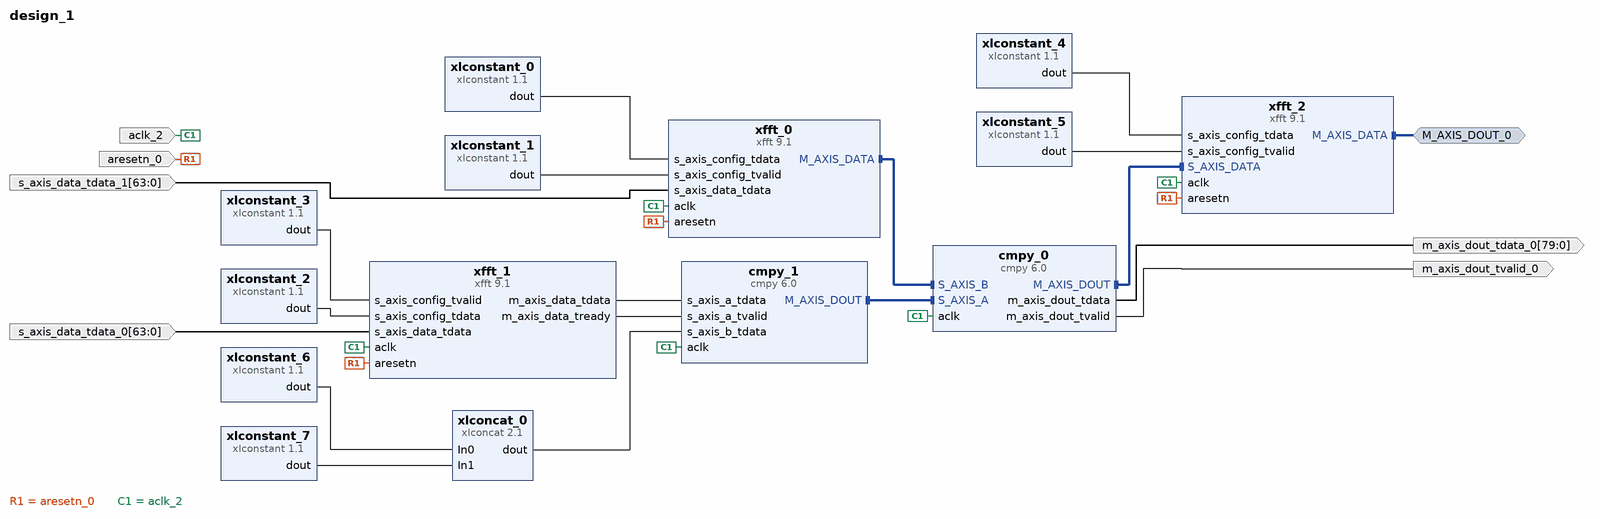
[diagram p0: block diagram of the top level]
# Vivado block design design_1, xczu28dr-ffvg1517-2-e, Vivado 2020.2
create_bd_design design_1

create_bd_intf_port -mode Master -vlnv xilinx.com:interface:axis_rtl:1.0 M_AXIS_DOUT_0
create_bd_port -dir I -type clk aclk_2
create_bd_port -dir I -type rst aresetn_0
create_bd_port -dir O -from 79 -to 0 m_axis_dout_tdata_0
create_bd_port -dir O m_axis_dout_tvalid_0
create_bd_port -dir I -from 63 -to 0 s_axis_data_tdata_0
create_bd_port -dir I -from 63 -to 0 s_axis_data_tdata_1

create_bd_cell -type ip -vlnv xilinx.com:ip:xfft:9.1 xfft_0
set_property -dict [list \
  CONFIG.aresetn true \
  CONFIG.channels 1 \
  CONFIG.data_format fixed_point \
  CONFIG.implementation_options automatically_select \
  CONFIG.number_of_stages_using_block_ram_for_data_and_phase_factors 3 \
  CONFIG.output_ordering natural_order \
  CONFIG.phase_factor_width 24 \
  CONFIG.target_data_throughput 50 \
  CONFIG.transform_length 1024 \
] [get_bd_cells xfft_0]
create_bd_cell -type ip -vlnv xilinx.com:ip:xlconstant:1.1 xlconstant_0
set_property -dict {CONFIG.CONST_WIDTH 64} [get_bd_cells xlconstant_0]
create_bd_cell -type ip -vlnv xilinx.com:ip:xlconstant:1.1 xlconstant_1
set_property -dict {CONFIG.CONST_WIDTH 1} [get_bd_cells xlconstant_1]
create_bd_cell -type ip -vlnv xilinx.com:ip:xlconstant:1.1 xlconstant_2
set_property -dict {CONFIG.CONST_WIDTH 64} [get_bd_cells xlconstant_2]
create_bd_cell -type ip -vlnv xilinx.com:ip:xlconstant:1.1 xlconstant_3
set_property -dict {CONFIG.CONST_WIDTH 1} [get_bd_cells xlconstant_3]
create_bd_cell -type ip -vlnv xilinx.com:ip:xfft:9.1 xfft_1
set_property -dict [list \
  CONFIG.aresetn true \
  CONFIG.channels 1 \
  CONFIG.data_format fixed_point \
  CONFIG.implementation_options automatically_select \
  CONFIG.number_of_stages_using_block_ram_for_data_and_phase_factors 0 \
  CONFIG.output_ordering natural_order \
  CONFIG.phase_factor_width 24 \
  CONFIG.target_data_throughput 50 \
  CONFIG.transform_length 32 \
] [get_bd_cells xfft_1]
create_bd_cell -type ip -vlnv xilinx.com:ip:cmpy:6.0 cmpy_0
set_property -dict {CONFIG.OutputWidth 32} [get_bd_cells cmpy_0]
create_bd_cell -type ip -vlnv xilinx.com:ip:xfft:9.1 xfft_2
set_property -dict [list \
  CONFIG.aresetn true \
  CONFIG.channels 1 \
  CONFIG.data_format fixed_point \
  CONFIG.implementation_options pipelined_streaming_io \
  CONFIG.number_of_stages_using_block_ram_for_data_and_phase_factors 0 \
  CONFIG.output_ordering natural_order \
  CONFIG.phase_factor_width 24 \
  CONFIG.target_data_throughput 50 \
  CONFIG.transform_length 32 \
] [get_bd_cells xfft_2]
create_bd_cell -type ip -vlnv xilinx.com:ip:xlconstant:1.1 xlconstant_4
set_property -dict {CONFIG.CONST_VAL 0 CONFIG.CONST_WIDTH 8} [get_bd_cells xlconstant_4]
create_bd_cell -type ip -vlnv xilinx.com:ip:xlconstant:1.1 xlconstant_5
set_property -dict {CONFIG.CONST_WIDTH 1} [get_bd_cells xlconstant_5]
create_bd_cell -type ip -vlnv xilinx.com:ip:cmpy:6.0 cmpy_1
create_bd_cell -type ip -vlnv xilinx.com:ip:xlconcat:2.1 xlconcat_0
set_property -dict {CONFIG.IN0_WIDTH 32 CONFIG.IN1_WIDTH 32 CONFIG.NUM_PORTS 2} [get_bd_cells xlconcat_0]
create_bd_cell -type ip -vlnv xilinx.com:ip:xlconstant:1.1 xlconstant_6
set_property -dict {CONFIG.CONST_WIDTH 32} [get_bd_cells xlconstant_6]
create_bd_cell -type ip -vlnv xilinx.com:ip:xlconstant:1.1 xlconstant_7
set_property -dict {CONFIG.CONST_VAL -1 CONFIG.CONST_WIDTH 32} [get_bd_cells xlconstant_7]

# ---- connections ----

connect_bd_intf_net [get_bd_intf_pins cmpy_1/M_AXIS_DOUT] [get_bd_intf_pins cmpy_0/S_AXIS_A]
connect_bd_intf_net [get_bd_intf_pins cmpy_0/S_AXIS_B] [get_bd_intf_pins xfft_0/M_AXIS_DATA]
connect_bd_intf_net [get_bd_intf_pins cmpy_0/M_AXIS_DOUT] [get_bd_intf_pins xfft_2/S_AXIS_DATA]
connect_bd_intf_net [get_bd_intf_ports M_AXIS_DOUT_0] [get_bd_intf_pins xfft_2/M_AXIS_DATA]
connect_bd_net [get_bd_pins xlconstant_0/dout] [get_bd_pins xfft_0/s_axis_config_tdata]
connect_bd_net [get_bd_pins xlconstant_1/dout] [get_bd_pins xfft_0/s_axis_config_tvalid]
connect_bd_net [get_bd_pins xlconstant_3/dout] [get_bd_pins xfft_1/s_axis_config_tvalid]
connect_bd_net -net aresetn_0_1 [get_bd_ports aresetn_0] [get_bd_pins xfft_0/aresetn] [get_bd_pins xfft_1/aresetn] [get_bd_pins xfft_2/aresetn]
connect_bd_net [get_bd_pins cmpy_0/m_axis_dout_tdata] [get_bd_ports m_axis_dout_tdata_0]
connect_bd_net [get_bd_pins cmpy_0/m_axis_dout_tvalid] [get_bd_ports m_axis_dout_tvalid_0]
connect_bd_net [get_bd_pins xlconstant_2/dout] [get_bd_pins xfft_1/s_axis_config_tdata]
connect_bd_net [get_bd_pins xlconstant_4/dout] [get_bd_pins xfft_2/s_axis_config_tdata]
connect_bd_net [get_bd_pins xlconstant_5/dout] [get_bd_pins xfft_2/s_axis_config_tvalid]
connect_bd_net -net aclk_2_1 [get_bd_ports aclk_2] \
  [get_bd_pins xfft_1/aclk] [get_bd_pins xfft_0/aclk] [get_bd_pins xfft_2/aclk] [get_bd_pins cmpy_0/aclk] \
  [get_bd_pins cmpy_1/aclk]
connect_bd_net -net s_axis_data_tdata_0_1 [get_bd_ports s_axis_data_tdata_0] [get_bd_pins xfft_1/s_axis_data_tdata]
connect_bd_net -net s_axis_data_tdata_1_1 [get_bd_ports s_axis_data_tdata_1] [get_bd_pins xfft_0/s_axis_data_tdata]
connect_bd_net [get_bd_pins xfft_1/m_axis_data_tdata] [get_bd_pins cmpy_1/s_axis_a_tdata]
connect_bd_net [get_bd_pins xfft_1/m_axis_data_tready] [get_bd_pins cmpy_1/s_axis_a_tvalid]
connect_bd_net [get_bd_pins xlconcat_0/dout] [get_bd_pins cmpy_1/s_axis_b_tdata]
connect_bd_net [get_bd_pins xlconstant_6/dout] [get_bd_pins xlconcat_0/In0]
connect_bd_net [get_bd_pins xlconstant_7/dout] [get_bd_pins xlconcat_0/In1]

set_property USER_COMMENTS.comment_1 {reset loop} [current_bd_design]
set_property USER_COMMENTS.comment_3 {FFT Channel 2} [current_bd_design]
set_property USER_COMMENTS.comment_0 {input clock trigger} [get_bd_cells /aclk_2]
set_property USER_COMMENTS.comment_2 {FFT channel 1} [get_bd_cells /xfft_0]

validate_bd_design
save_bd_design
